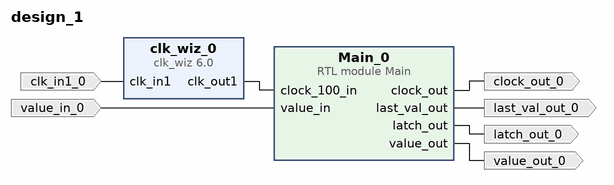
[diagram p0: block diagram of the top level]
# Vivado block design design_1, xc7z020clg400-1, Vivado 2021.2
create_bd_design design_1

create_bd_port -dir I value_in_0
create_bd_port -dir O value_out_0
create_bd_port -dir O last_val_out_0
create_bd_port -dir O -type clk clock_out_0
create_bd_port -dir O latch_out_0
create_bd_port -dir I -type clk clk_in1_0
set_property -dict {CONFIG.FREQ_HZ 125000000} [get_bd_ports clk_in1_0]

create_bd_cell -type ip -vlnv xilinx.com:ip:clk_wiz:6.0 clk_wiz_0
set_property -dict [list \
  CONFIG.CLKIN1_JITTER_PS 80.0 \
  CONFIG.CLKOUT1_JITTER 124.615 \
  CONFIG.CLKOUT1_PHASE_ERROR 96.948 \
  CONFIG.CLKOUT1_REQUESTED_OUT_FREQ 100 \
  CONFIG.MMCM_CLKFBOUT_MULT_F 8.000 \
  CONFIG.MMCM_CLKIN1_PERIOD 8.000 \
  CONFIG.MMCM_CLKOUT0_DIVIDE_F 10.000 \
  CONFIG.MMCM_DIVCLK_DIVIDE 1 \
  CONFIG.PRIM_IN_FREQ 125.000 \
  CONFIG.USE_LOCKED false \
  CONFIG.USE_RESET false \
] [get_bd_cells clk_wiz_0]
create_bd_cell -type module -reference Main Main_0

# ---- connections ----

connect_bd_net [get_bd_pins Main_0/clock_out] [get_bd_ports clock_out_0]
connect_bd_net [get_bd_pins Main_0/last_val_out] [get_bd_ports last_val_out_0]
connect_bd_net [get_bd_pins Main_0/latch_out] [get_bd_ports latch_out_0]
connect_bd_net [get_bd_pins Main_0/value_out] [get_bd_ports value_out_0]
connect_bd_net -net clk_in1_0_1 [get_bd_ports clk_in1_0] [get_bd_pins clk_wiz_0/clk_in1]
connect_bd_net [get_bd_pins clk_wiz_0/clk_out1] [get_bd_pins Main_0/clock_100_in]
connect_bd_net -net value_in_0_1 [get_bd_ports value_in_0] [get_bd_pins Main_0/value_in]

validate_bd_design
save_bd_design
